# EAGLE schematic MESP_0_1 (EAGLE 8.0.0)
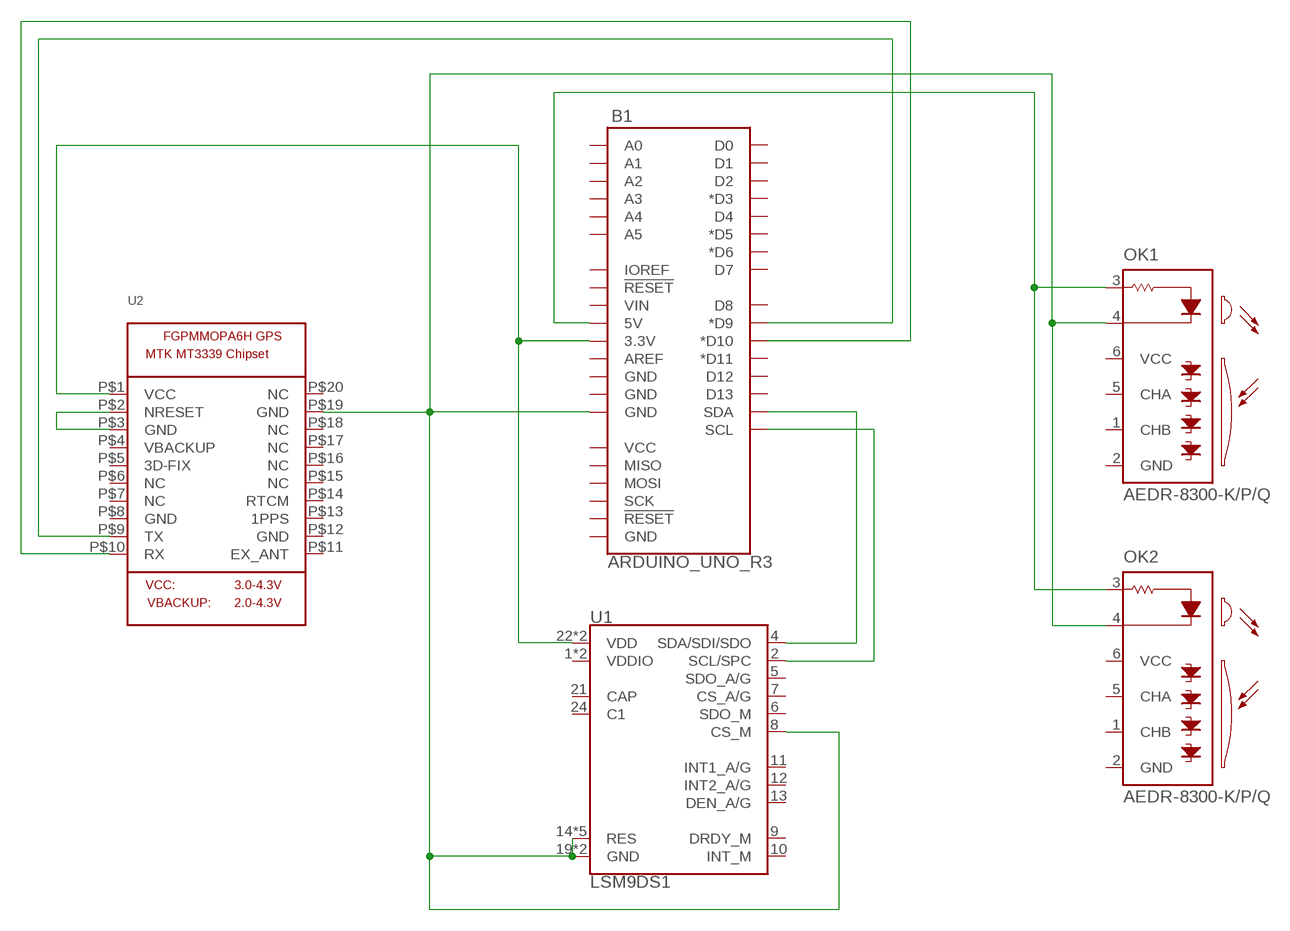
[diagram p0: schematic, sheet 1]

## Parts
B1  ARDUINO_UNO_R3  [ARDUINO_R3]
OK1  AEDR-8300-K/P/Q  [AEDR-8300]
OK2  AEDR-8300-K/P/Q  [AEDR-8300]
U1  LSM9DS1  [LGA-24-3.5X3]
U2  MICROBUILDER_GPS_FGPMMOPA6H  [MICROBUILDER_FGPMMOPA6H]

## Nets
N$2: B1.3.3V U1.22(VDD) U1.23(VDD) U2.P$1(VCC)
N$3: B1.D9(*D9) U2.P$9(TX)
N$4: B1.SDA U1.4(SDA/SDI/SDO)
N$5: B1.SCL U1.2(SCL/SPC)
N$6: B1.D10(*D10) U2.P$10(RX)
N$7: U2.P$2(NRESET) U2.P$3(GND)
N$8: B1.GND@2(GND) OK1.4(C) OK2.4(C) U1.8(CS_M) U1.14(RES) U1.15(RES) U1.16(RES) U1.17(RES) U1.18(RES) U1.19(GND) U1.20(GND) U2.P$19(GND)
N$9: B1.5V OK1.3(A) OK2.3(A)
Unconnected: B1.A0 B1.A1 B1.A2 B1.A3 B1.A4 B1.A5 B1.AREF B1.D0 B1.D1 B1.D2 B1.D3(*D3) B1.D4 B1.D5(*D5) B1.D6(*D6) B1.D7 B1.D8 B1.D11(*D11) B1.D12 B1.D13 B1.GND@1(GND) B1.GND@3(GND) B1.GND@4(GND) B1.IOREF B1.MISO B1.MOSI B1.RESET@1(!RESET!) B1.RESET@2(!RESET!) B1.SCK B1.VCC B1.VIN OK1.1(CHB) OK1.2(GND) OK1.5(CHA) OK1.6(VCC) OK2.1(CHB) OK2.2(GND) OK2.5(CHA) OK2.6(VCC) U1.1(VDDIO) U1.3(VDDIO) U1.5(SDO_A/G) U1.6(SDO_M) U1.7(CS_A/G) U1.9(DRDY_M) U1.10(INT_M) U1.11(INT1_A/G) U1.12(INT2_A/G) U1.13(DEN_A/G) U1.21(CAP) U1.24(C1) U2.P$4(VBACKUP) U2.P$5(3D-FIX) U2.P$6(NC) U2.P$7(NC) U2.P$8(GND) U2.P$11(EX_ANT) U2.P$12(GND) U2.P$13(1PPS) U2.P$14(RTCM) U2.P$15(NC) U2.P$16(NC) U2.P$17(NC) U2.P$18(NC) U2.P$20(NC)

## Power pins joined to a net without a drawn wire
GND: OK1.E1(GND) OK1.E2(GND) OK2.E1(GND) OK2.E2(GND)

## Library data of the parts
B1 = SparkFun-Boards:ARDUINO_UNO_R3: Arduino R3 Footprint with SPI header Arduino Uno R3 Compatible Footprint. Matches PCB size of the original board. SparkFun Products: SAMD21 Dev Breakout <https://www.sparkfun.com/products/13672> RedBoard <https://www.sparkfun.com/products/12757> R3 Stackable Headers <https://www.sparkfun.com/products/11417>
OK1 OK2 = optocoupler:AEDR-8300-K: Agilent AEDR-8300 Series Encoders Reflective Surface Mount Optical Encoder Source: http: http://www.avagotech.com .. AV02-0088EN-1.pdf; MF: AGILENT TECHNOLOGIES; MPN: AEDR-8300-1P2; OC_FARNELL: 1161102; OC_NEWARK: 08J1020
U1 = SparkFun-Sensors:LSM9DS1: ST Microelectronics LSM9DS1 9DOF IMU - Accelerometer, Gyroscope & Magnetometer The LSM9DS1 is a versatile, motion-sensing system-in-a-chip. It houses a 3-axis accelerometer, 3-axis gyroscope, and 3-axis magnetometer – nine degrees of freedom (9DOF) in a single IC! The LSM9DS1 is equipped with a digital interface, but even that is flexible: it supports both I2C and SPI, so you’ll be hard-pressed to find a microcontroller it doesn’t work with. Datasheet <https://cdn.sparkfun.com/assets/learn_tutorials/3/7/3/LSM9DS1_Datasheet.pdf> SparkFun Products SparkFun 9 Degrees of Freedom IMU Breakout - LSM9DS1 <https://www.sparkfun.com/products/13284> (SEN-13284) SparkFun Photon IMU Shield <https://www.sparkfun.com/products/13629> (DEV-13629); PROD_ID: IC-12536
U2 = Adafruit Ultimate GPS:MICROBUILDER_GPS_FGPMMOPA6H: GPS Module - MTK MT3339 Chipset, -165dBm sensitivity, 22 channels, 10Hz, auto-select external antenna options

## Module GPS_BREAKOUT
Ports: 

### Library data of the parts